# EAGLE design untitled (EAGLE 9.6.2)
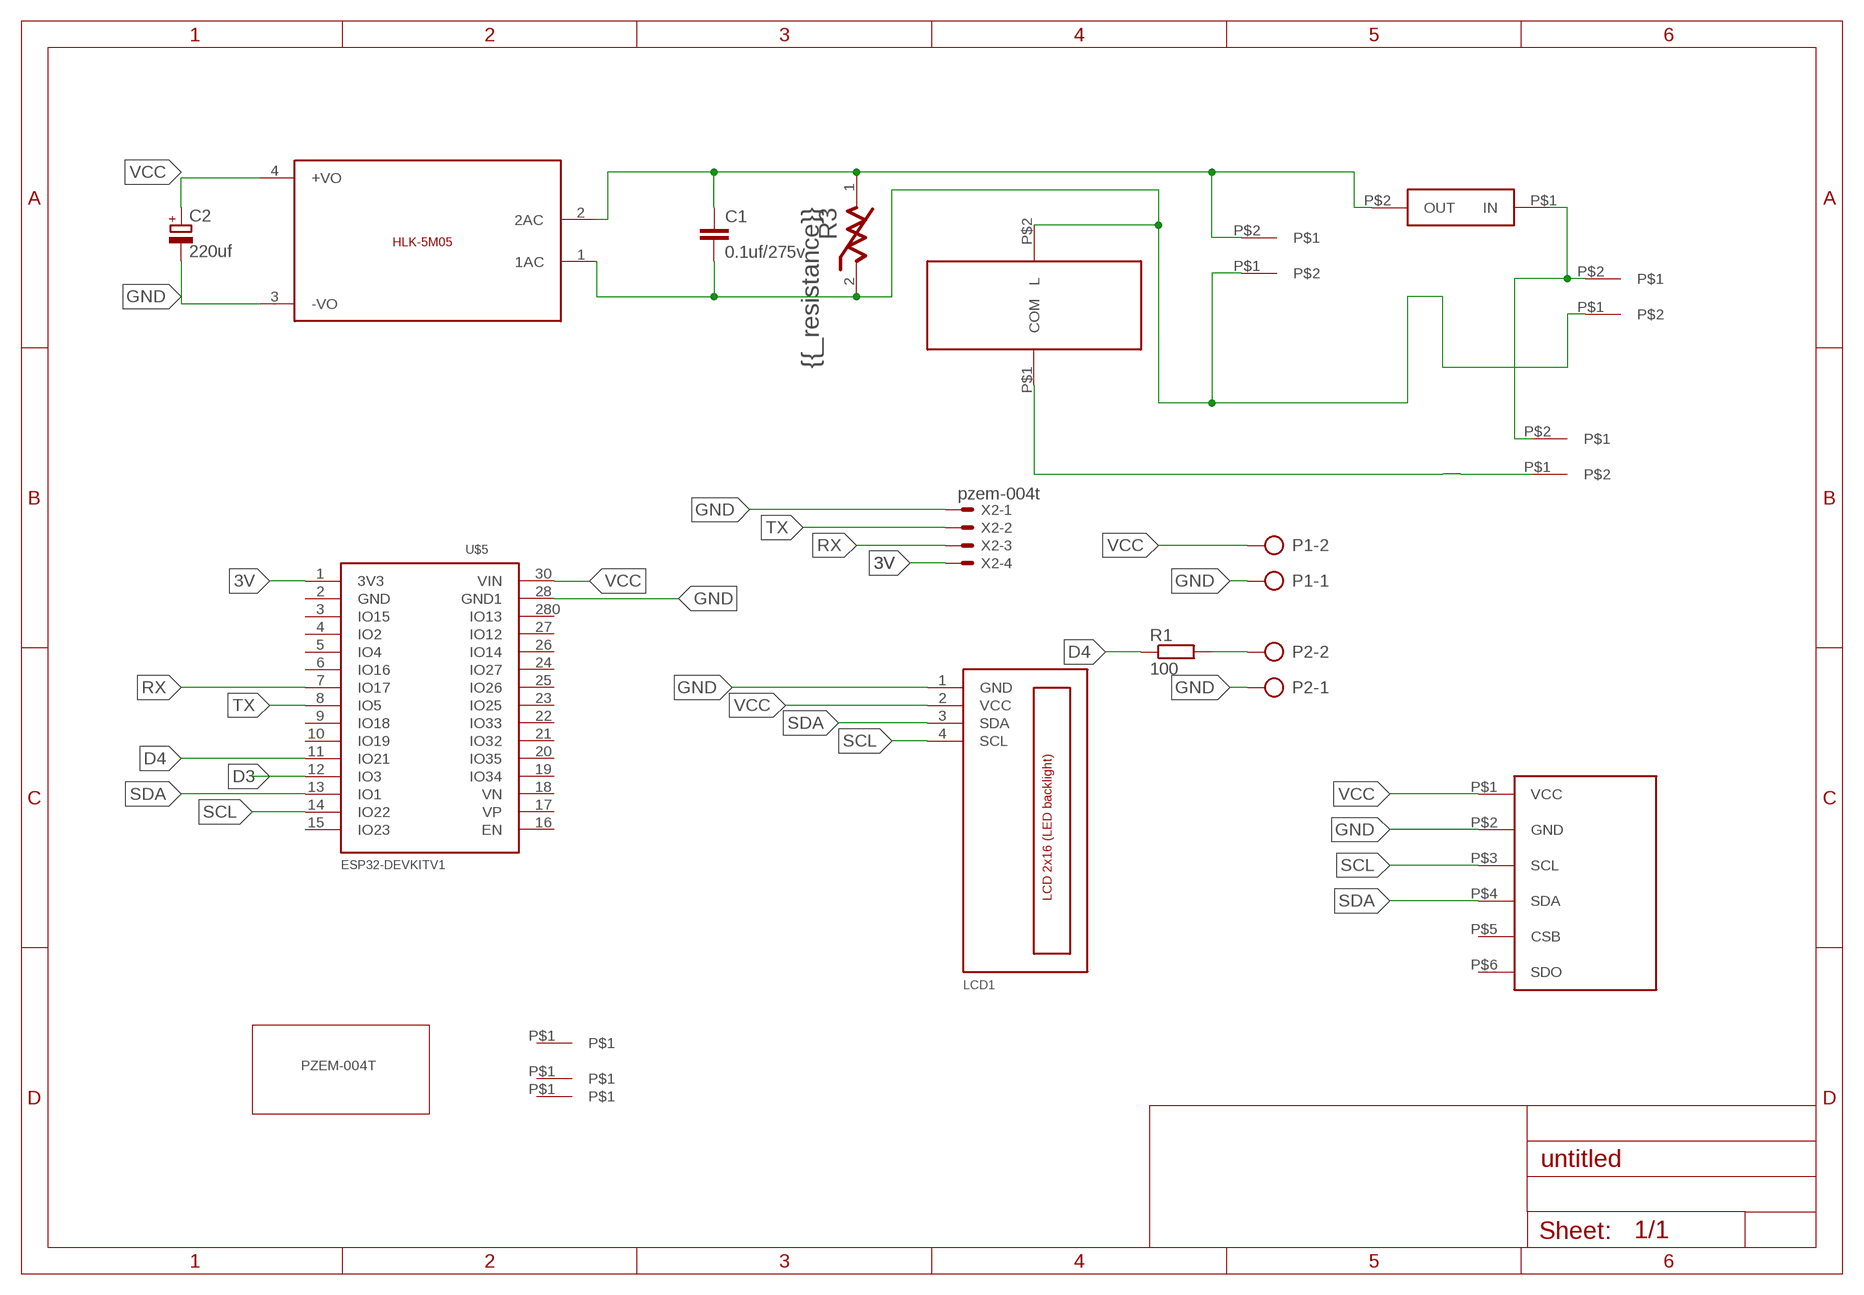
[diagram p0: schematic, sheet 1]

## Parts
1  KF76  [KF76]
220  KF76  [KF76]
BME280  BMP180  [BPM180]
C1  0.1uf/275v  C7.5/5  [C7.5B5]
C2  220uf  CPOL-EUE2-5  [E2-5]
LCD1  LCD_2X16_SIL  [HY-1602F]
P1  AK500/2-H  [AK500/2-H]
P2  AK500/2-H  [AK500/2-H]
PZEM  KF76  [KF76]
R1  100  R-EU_0207/12  [0207/12]
R3  10D561K  BOURNS_INC_MOV-10D471KBOURNS_INC_MOV-10D471K_0_0  [BOURNS_INC_MOV-10D471K_0]
U$1  5VDC/5W  HLK-5M05  [HLK-5M05]
U$2  TOROID  [TOROID]
U$3  PZEM  [PZEM_FOOTPRINT]
U$4  SAPCER  [SPACER]
U$5  ESP32DEVKITV1  [ESP32-DEVKITV1]
U$6  SAPCER  [SPACER]
U$7  SAPCER  [SPACER]
U$8  FUSE  [FUSE]
X2  pzem-004t  22-23-2041  [22-23-2041]

## Nets
3V: U$5.1(3V3) X2.4
D3: U$5.12(IO3)
D4: R1.1 U$5.11(IO21)
GND: BME280.P$2(GND) C2.- LCD1.1(GND) P1.1 P2.1 U$1.3(-VO) U$5.28(GND1) X2.1
N$1: P2.2 R1.2
N$2: 1.P$1 U$2.P$1(COM)
N$7: C1.1 PZEM.P$2 R3.1 U$1.2(2AC) U$8.P$2(OUT)
N$9: 1.P$2 220.P$2 U$8.P$1(IN)
N$21: 220.P$1 C1.2 PZEM.P$1 R3.2 U$1.1(1AC) U$2.P$2(L)
RX: U$5.7(IO17) X2.3
SCL: BME280.P$3(SCL) LCD1.4(SCL) U$5.14(IO22)
SDA: BME280.P$4(SDA) LCD1.3(SDA) U$5.13(IO1)
TX: U$5.8(IO5) X2.2
VCC: BME280.P$1(VCC) C2.+ LCD1.2(VCC) P1.2 U$1.4(+VO) U$5.30(VIN)
Unconnected: BME280.P$5(CSB) BME280.P$6(SDO) U$4.P$1 U$5.2(GND) U$5.3(IO15) U$5.4(IO2) U$5.5(IO4) U$5.6(IO16) U$5.9(IO18) U$5.10(IO19) U$5.15(IO23) U$5.16(EN) U$5.17(VP) U$5.18(VN) U$5.19(IO34) U$5.20(IO35) U$5.21(IO32) U$5.22(IO33) U$5.23(IO25) U$5.24(IO27) U$5.25(IO26) U$5.26(IO14) U$5.27(IO12) U$5.280(IO13) U$6.P$1 U$7.P$1

## Library data of the parts
1 220 PZEM = kf76:KF76
BME280 = bme280:BMP180
C1 = capacitor-wima:C: CAPACITOR naming: grid - package width
C2 = rcl:CPOL-EU: POLARIZED CAPACITOR, European symbol; SPICEPREFIX: C
LCD1 = lcd_2x16_led_backlight:LCD_2X16_SIL
P1 P2 = ak5002:AK500/2-H: CONNECTOR Aug. 2004 / PTR Meßtechnik: Die Bezeichnung der Serie AK505 wurde geändert. Es handelt sich hierbei um AK500 in horizontaler Ausführung.; OC_FARNELL: unknown; OC_NEWARK: unknown
R1 = rcl:R-EU_: RESISTOR, European symbol; SPICEPREFIX: R
R3 = Bourns Inc. - MOV-10D471K:BOURNS_INC_MOV-10D471K: 470V 2.5kA Varistor 1 Circuit Through Hole Disc 10mm; AUTOMOTIVE: No; CAPACITANCE: 252pF; CENTROID_NOT_SPECIFIED: No; CLAMPING_CURRENT: 25A; CLAMPING_VOLTAGE: 775V; DATASHEET: https://www.bourns.com/docs/product-datasheets/mov10d.pdf?sfvrsn=b57e8a7f_26; DEVICE_CLASS_L1: Circuit Protection; DEVICE_CLASS_L2: Varistors; DEVICE_CLASS_L3: unset; DIGIKEY_DESCRIPTION: VARISTOR 470V 2.5KA DISC 10MM; DIGIKEY_PART_NUMBER: MOV-10D471K-ND; FOOTPRINT_VARIANT_NAME_0: Recommended_Land_Pattern; HEIGHT: 15.5mm; LEAD_FREE: Yes; MF: Bourns Inc.; MOUSER_DESCRIPTION: Var MOV 300VAC/385VDC 2500A 470V Thru-Hole Radial Bulk; MOUSER_PART_NUMBER: 652-MOV-10D471K; MPN: MOV-10D471K; PACKAGE: RADIAL; PREFIX: R; ROHS: Yes; TEMPERATURE_RANGE_HIGH: +105°C; TEMPERATURE_RANGE_LOW: -40°C; VARISTOR_VOLTAGE: 470V; VERIFICATION_VERSION: 0.0.0.3; VOLTAGE_RATING_AC: 300V; VOLTAGE_RATING_DC: 385V; VOLTAGE_TOLERANCE: 10%
U$1 = HLK-5M05:HLK-5M05: HLK-5M05 is an 5Volt/5W smps developed by HI-LINK; SIZE: 23x38(mm)
U$2 = TOROID:TOROID
U$3 = pzem30mmm:PZEM
U$4 U$6 U$7 = spacer:SAPCER
U$5 = ESP32-DEVKITV1:ESP32DEVKITV1
U$8 = fuse3d:FUSE
X2 = con-molex:22-23-2041: .100" (2.54mm) Center Header - 4 Pin; MF: MOLEX; MPN: 22-23-2041; OC_FARNELL: 1462920; OC_NEWARK: 38C0355

## Board
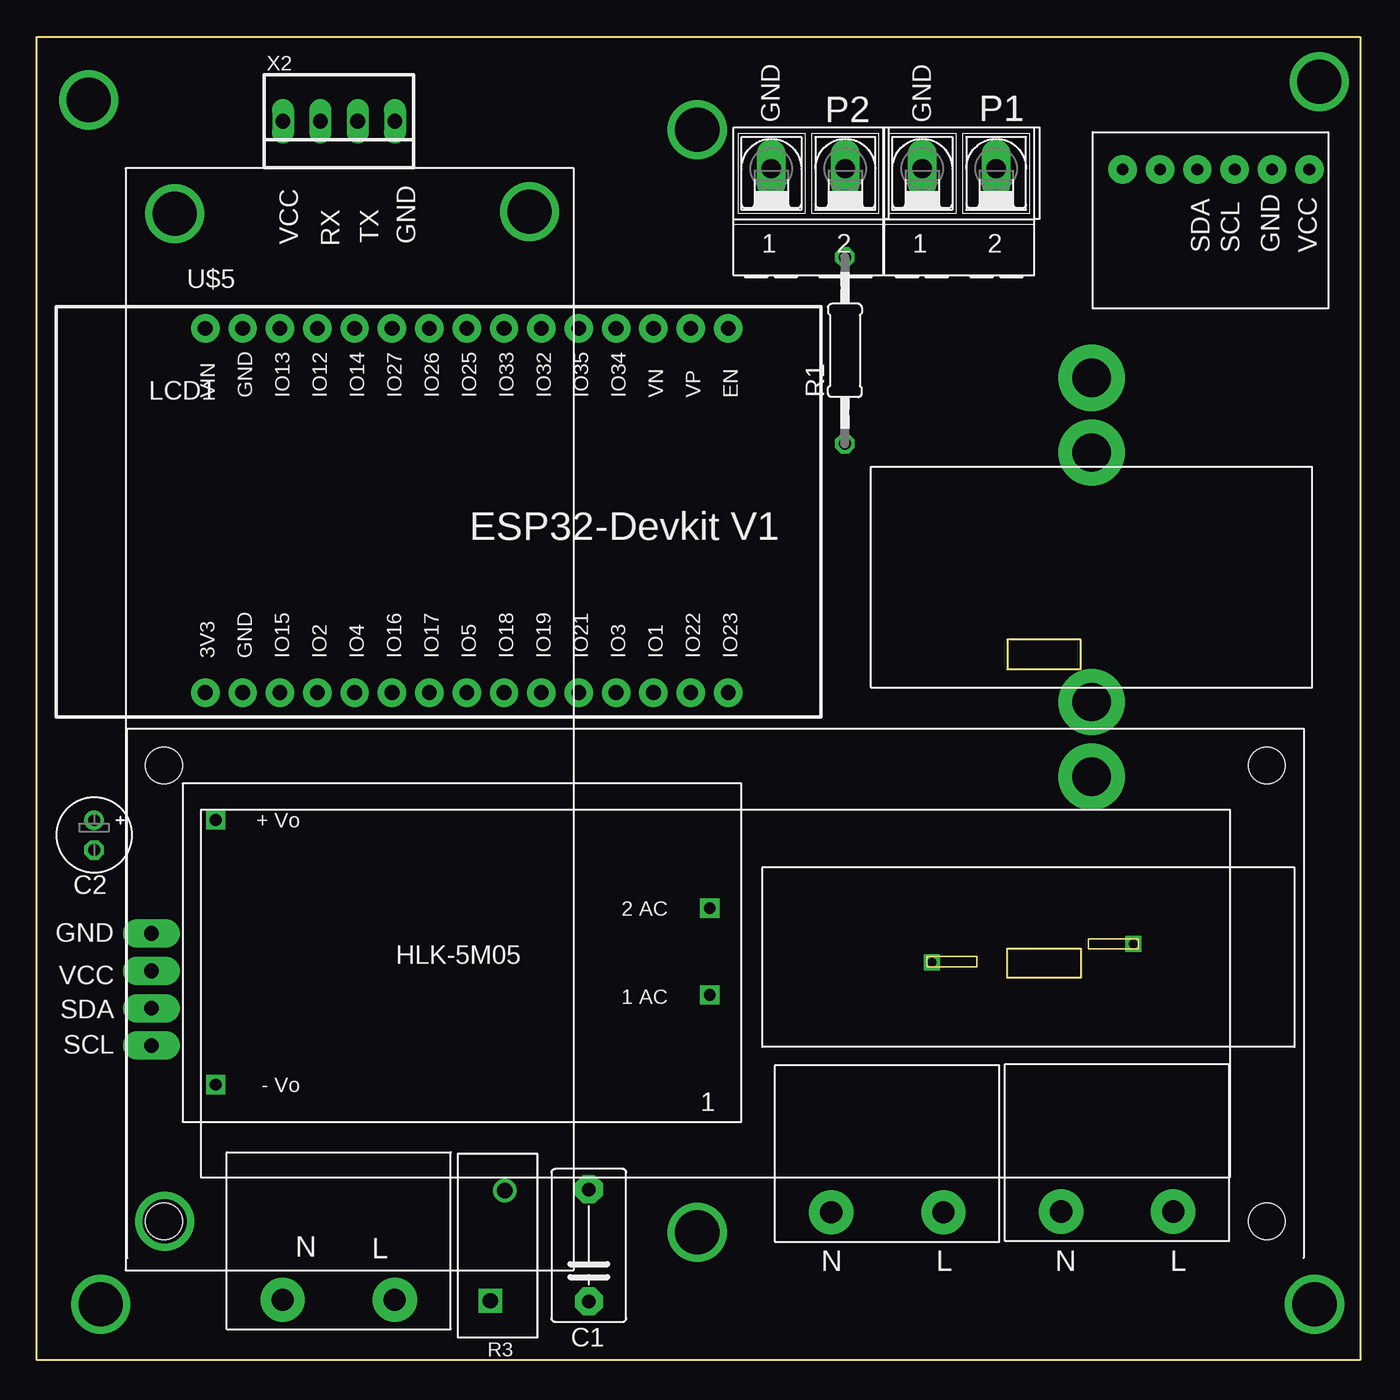
[diagram p1: board, top side]
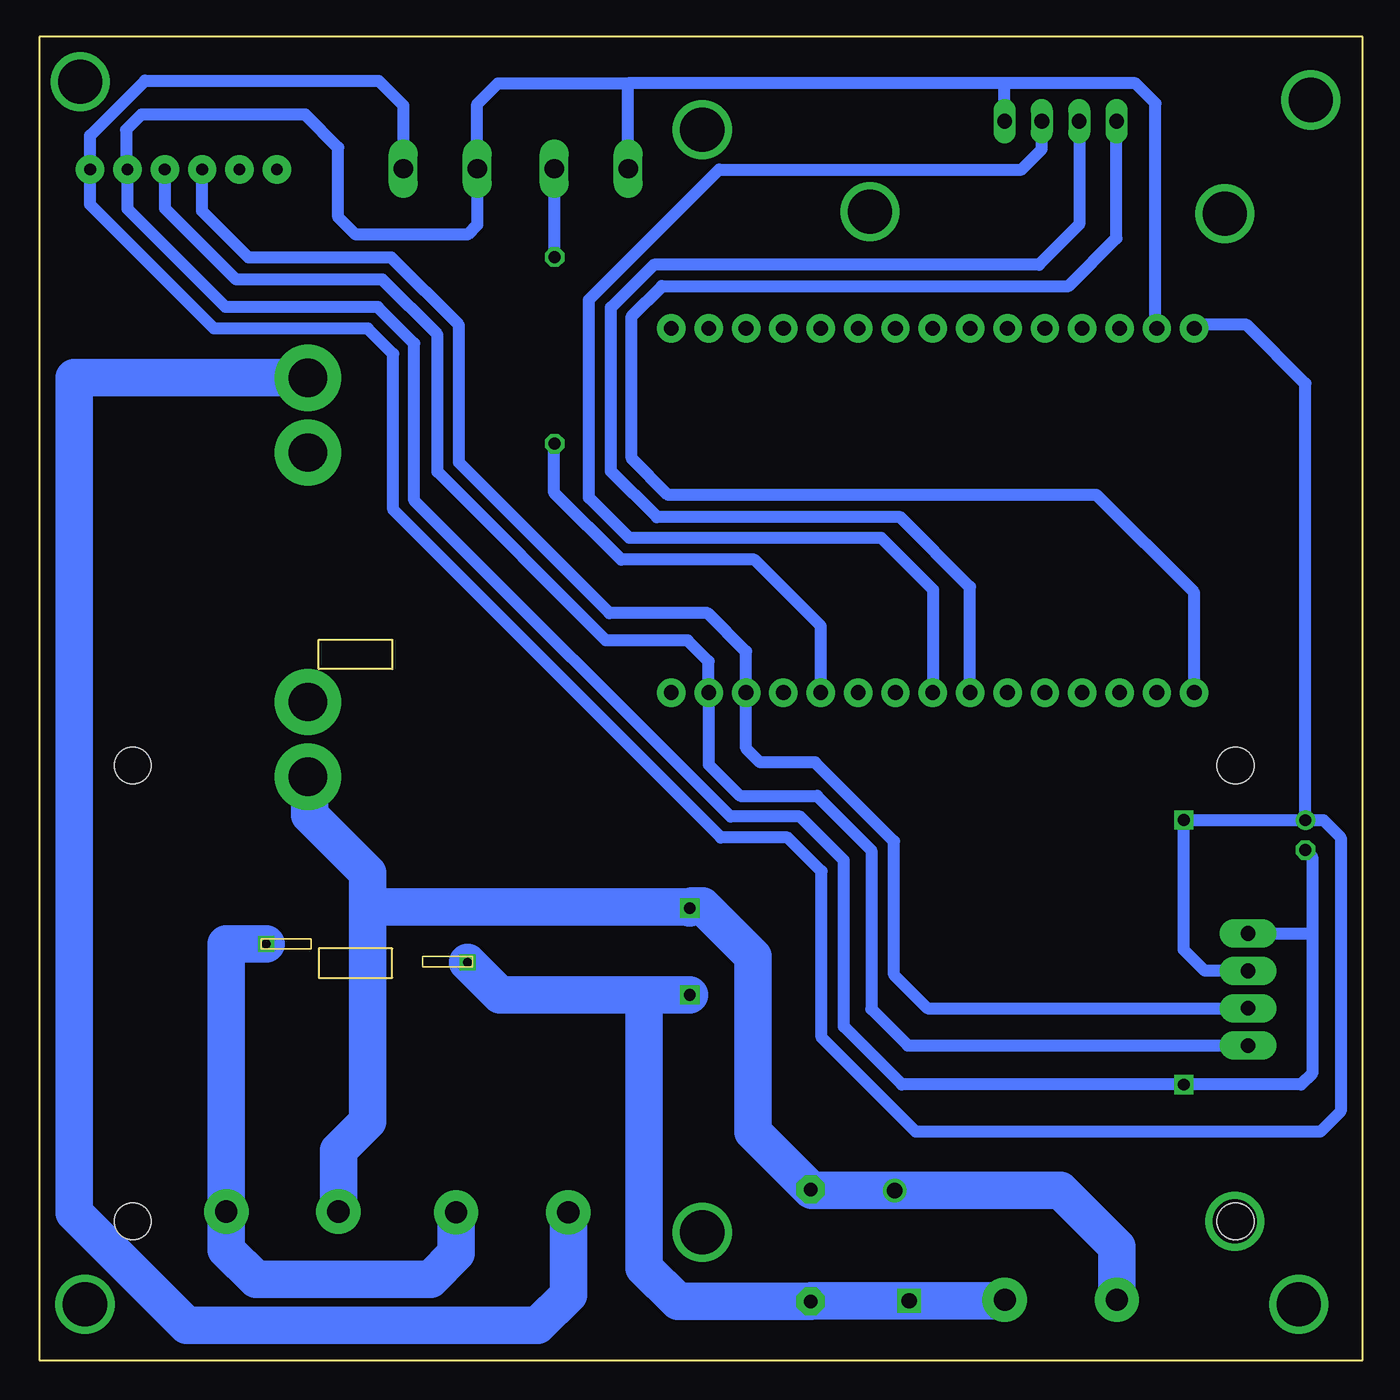
[diagram p2: board, bottom side, seen from below]

Size 90 x 90 mm. Coordinates in mm from the lower left corner, seen from the top.
Outline: 0,0 0,90 90,90 90,0 0,0
Copper layers (1*16): Top 0.035mm / dielectric 1.5mm / Bottom 0.035mm
Design rules "default *": minimum track width 6mil, minimum drill 0.35mm, track to track 0.6mm, track to pad 0.6mm, pad to pad 0.6mm, via to via 0.6mm, smd to smd 0.5mm, copper to edge 40mil, drill to drill 6mil, minimum pad ring 10mil, minimum via ring 8mil, stop-mask expansion 4mil, vias tented up to drill 0mil, thermal gap 10mil
Milling: 8 lines

### Footprints (pad centres in the part's own frame; a part is rotated, then mirrored left to right if it is on the bottom)
KF76 = drill 1.5 pad 3: P$1 3.81,2; P$2 11.43,2
BPM180 = drill 0.8 pad 1.93: P$1 1.27,2.54; P$2 3.81,2.54; P$3 6.35,2.54; P$4 8.89,2.54; P$5 11.43,2.54; P$6 13.97,2.54
C7.5B5 = drill 0.914 pad 1.905 octagon: 1 -3.81,0; 2 3.81,0
E2-5 = drill 0.813 pad 1.27: + -1.016,0 | drill 0.813 pad 1.27 octagon: - 1.016,0
HY-1602F = drill 1 pad 1.93 long: 1 -3.81,-11.43; 2 -3.81,-13.97; 3 -3.81,-16.51; 4 -3.81,-19.05 | hole 2.5: -2.96,0; 72.04,0; -2.96,-31; 72.04,-31
AK500/2-H = drill 1.321 long: 1 -2.515,0; 2 2.515,0
0207/12 = drill 0.813 octagon: 1 -6.35,0; 2 6.35,0
BOURNS_INC_MOV-10D471K_0 = drill 1.05 pad 1.6 square: 1 -3.75,0.5 | drill 1.05 pad 1.6: 2 3.75,-0.5
HLK-5M05 = drill 0.8 square: 1 -16.85,-2.93; 2 -16.85,2.97; 3 16.75,9.07; 4 16.75,-8.93
TOROID = drill 2.6 pad 4.5: P$1 15,21.05; P$2 15,-6.08; P$3 15,15.97; P$4 15,-1
SPACER = drill 3: P$1 0,0
ESP32-DEVKITV1 = drill 1 pad 1.93: 1 -22.87,-13.54; 2 -20.33,-13.54; 3 -17.79,-13.54; 4 -15.25,-13.54; 5 -12.71,-13.54; 6 -10.17,-13.54; 7 -7.63,-13.54; 8 -5.09,-13.54; 9 -2.55,-13.54; 10 -0.01,-13.54; 11 2.53,-13.54; 12 5.07,-13.54; 13 7.61,-13.54; 14 10.15,-13.54; 15 12.69,-13.54; 16 12.69,11.23; 17 10.15,11.23; 18 7.61,11.23; 19 5.07,11.23; 20 2.53,11.23; 21 -0.01,11.23; 22 -2.55,11.23; 23 -5.09,11.23; 24 -7.63,11.23; 25 -10.17,11.23; 26 -12.71,11.23; 27 -15.25,11.23; 28 -20.33,11.23; 30 -22.87,11.23; 280 -17.79,11.23
FUSE = drill 0.6 pad 0.1 square: P$1 -6.85,-0.6; P$2 6.85,0.65
22-23-2041 = drill 1 long: 1 -3.81,0; 2 -1.27,0; 3 1.27,0; 4 3.81,0

### Placement (x,y rotation side)
1  50.22,8.04 0 top
220  65.85,8.11 0 top
BME280  87.82,83.52 180 top
C1  37.55,7.8 90 top
C2  3.9,35.7 270 top
LCD1  11.61,40.45 0 top
P1  62.74,81.03 0 top
P2  52.47,81.03 0 top
PZEM  12.92,2.11 0 top
R1  54.96,68.67 90 top
R3  31.34,7.79 90 top
U$1  28.92,27.81 180 top
U$2  56.73,45.75 0 top
U$3  36.52,81.05 180 top
U$4  8.7,9.43 0 top
U$5  34.33,58.94 0 top
U$6  3.52,85.7 90 top
U$7  33.51,78.1 0 top
U$8  67.73,27.7 180 top
X2  20.55,84.26 180 top

### Tracks (layer width: path | path; a pad name or v marks a point on that pad's centre or on a via)
3V
  Bottom 0.813: X2.4 16.74,76.3 19.99,73.05 47.66,73.05 49.72,70.99 49.72,61.33 47.23,58.84 18.12,58.84 11.46,52.19 U$5.1
D4
  Bottom 0.813: U$5.11 36.86,49.91 41.38,54.43 50.44,54.43 54.98,58.98 54.98,62.3 R1.1
GND
  Bottom 0.813: 7.75,28.96 LCD1.1 3.56,29.02 3.44,29.14 | 3.44,29.14 3.44,19.48 4.18,18.74 U$1.3 31.35,18.74 35.3,22.69 35.3,33.98 38.27,36.96 42.99,36.96 64.5,58.47 64.5,69.13 66.98,71.61 77.33,71.61 84.01,78.29 BME280.P$2 84.1,81.07 84.1,83.67 83.07,84.7 71.91,84.7 69.67,82.46 69.67,77.72 68.49,76.55 60.89,76.55 60.22,77.21 P1.1 60.22,85.42 58.81,86.84 49.96,86.84 | C2.- 3.44,34.23 3.44,29.14 | 24.42,84.32 X2.1 24.36,86.82 24.39,86.84 | U$5.28 14.09,70.26 14.09,85.48 15.45,86.84 24.39,86.84 | 24.39,86.84 49.96,86.84 | P2.1 49.96,86.84
N$1
  Bottom 0.813: R1.2 54.96,81 P2.2
N$2
  Bottom 2.54: 1.P$1 54.03,4.45 56.11,2.36 79.97,2.36 87.64,10.03 87.64,66.8 U$2.P$1
N$4  (via drill 3)
  other vias: 44.92,83.69
N$6  (via drill 3)
  other vias: 44.92,8.69
N$7
  Bottom 2.54: U$8.P$2 58.66,24.84 48.8,24.84 | 48.8,24.84 U$1.2 | PZEM.P$2 24.42,4.04 R3.1 37.5,4.04 C1.1 46.58,3.99 48.87,6.28 48.87,24.76 48.8,24.84
N$9
  Bottom 2.54: U$8.P$1 77.28,28.3 220.P$2 77.28,7.51 75.27,5.5 63.4,5.5 61.65,7.25 1.P$2
N$10  (via drill 3)
  other vias: 9.38,77.98
N$12  (via drill 3)
  other vias: 87.23,86.93
N$13  (via drill 3)
  other vias: 86.9,3.81
N$14  (via drill 3)
  other vias: 4.35,3.81
N$21
  Bottom 2.54: U$2.P$2 71.62,39.56 71.62,37.08 67.68,33.13 67.68,30.46 | PZEM.P$1 16.73,7.71 20.55,11.54 R3.2 37.47,11.54 C1.2 41.46,15.53 41.46,27.46 44.9,30.89 45.62,30.89 U$1.1 45.86,30.82 67.68,30.82 67.68,16.26 69.66,14.27 220.P$1
RX
  Bottom 0.813: X2.3 19.28,77.24 22.02,74.5 48.21,74.5 51.13,71.58 51.13,60.45 48.01,57.33 31.44,57.33 26.7,52.59 U$5.7
SCL
  Bottom 0.813: LCD1.4 30.94,21.39 33.42,23.88 33.42,34.67 37.12,38.37 42.35,38.37 44.48,40.5 U$5.14 44.48,47.52 45.91,48.94 51.47,48.94 62.93,60.41 62.93,69.73 66.69,73.48 76.62,73.48 81.47,78.34 BME280.P$3
SDA
  Bottom 0.813: LCD1.3 7.82,23.92 29.6,23.92 31.88,26.2 31.88,35.29 37.25,40.66 40.99,40.66 41.94,41.61 U$5.13 41.94,48.2 44.53,50.8 51.23,50.8 61.47,61.04 61.47,70.39 66.07,74.98 75.77,74.98 78.93,78.14 BME280.P$4
TX
  Bottom 0.813: X2.2 21.82,82.36 23.21,80.97 43.77,80.97 52.62,72.12 52.62,58.66 49.88,55.91 32.74,55.91 29.22,52.39 29.22,45.42 U$5.8
VCC
  Bottom 0.813: LCD1.2 10.74,26.48 12.17,27.91 U$1.4 12.15,36.72 C2.+ | C2.+ 3.9,66.42 7.88,70.41 11.22,70.41 U$5.30 | C2.+ 2.67,36.72 1.5,35.55 1.5,16.93 2.89,15.53 30.4,15.53 36.8,21.94 36.8,33.24 39.11,35.54 43.65,35.54 65.94,57.83 65.94,68.42 67.67,70.15 78.12,70.15 86.55,78.58 BME280.P$1 86.55,83.28 82.81,87.02 82.79,86.99 66.91,86.99 65.25,85.33 P1.2

### Text on the board
tNames: GND | GND | VCC | RX | TX | GND | SDA | SCL | GND | VCC | GND | VCC | SDA | SCL | N | L | N | L | N | L